# EAGLE design RadarEyes (EAGLE 9.2.2)
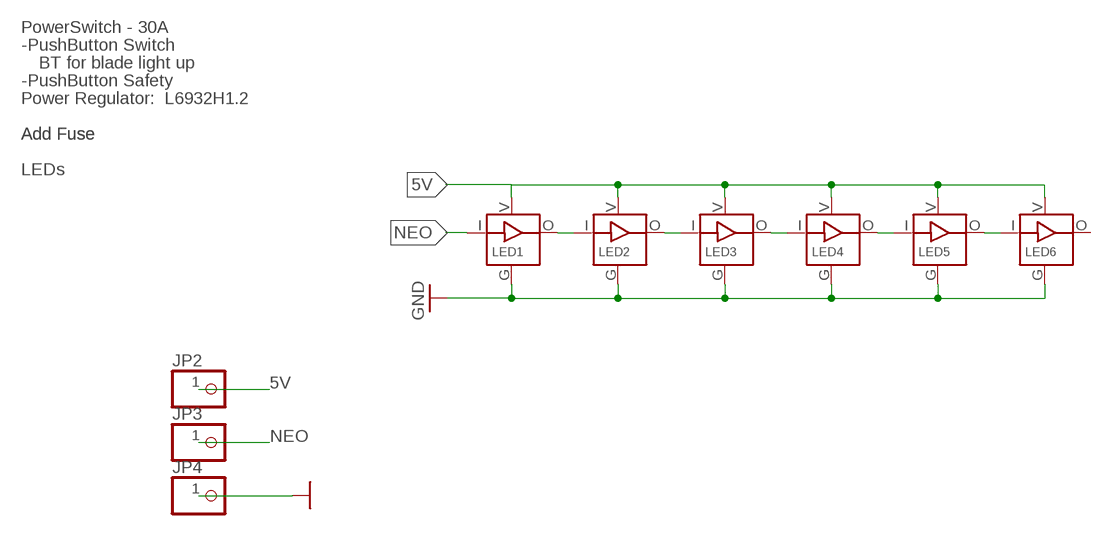
[diagram p0: schematic, sheet 1]

## Parts
JP2  PINHD-1X1  [1X01]
JP3  PINHD-1X1  [1X01]
JP4  PINHD-1X1  [1X01]
LED1  SK6812_3535  [LED3535]
LED2  SK6812_3535  [LED3535]
LED3  SK6812_3535  [LED3535]
LED4  SK6812_3535  [LED3535]
LED5  SK6812_3535  [LED3535]
LED6  SK6812_3535  [LED3535]

## Nets
5V: JP2.1 LED1.V(VDD) LED2.V(VDD) LED3.V(VDD) LED4.V(VDD) LED5.V(VDD) LED6.V(VDD)
GND: JP4.1 LED1.G(GND) LED2.G(GND) LED3.G(GND) LED4.G(GND) LED5.G(GND) LED6.G(GND)
N$1: LED1.O(DO) LED2.I(DI)
N$2: LED2.O(DO) LED3.I(DI)
N$3: LED3.O(DO) LED4.I(DI)
N$4: LED4.O(DO) LED5.I(DI)
N$5: LED5.O(DO) LED6.I(DI)
NEO: JP3.1 LED1.I(DI)
Unconnected: LED6.O(DO)

## Notes on the sheet
- PowerSwitch - 30A
- -PushButton Switch
- BT for blade light up
- -PushButton Safety
- Power Regulator:  L6932H1.2
- Add Fuse | Add Fuse
- LEDs

## Library data of the parts
JP2-JP4 = adafruit:PINHD-1X1: Pin header 1x1 for 0.1" spacing With round pins
LED1-LED6 = SK6812:SK6812

## Board
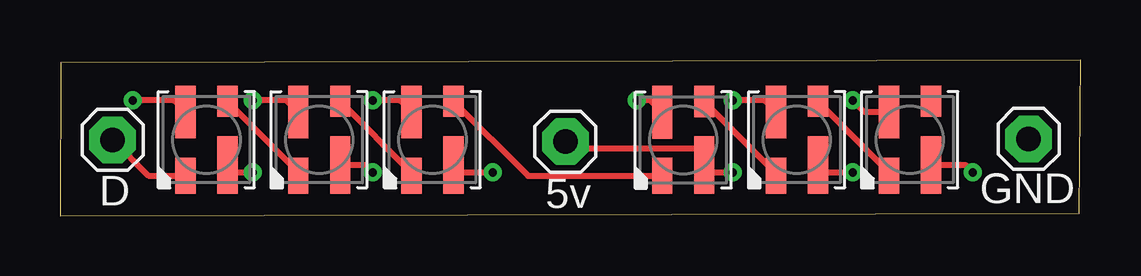
[diagram p1: board, top side]
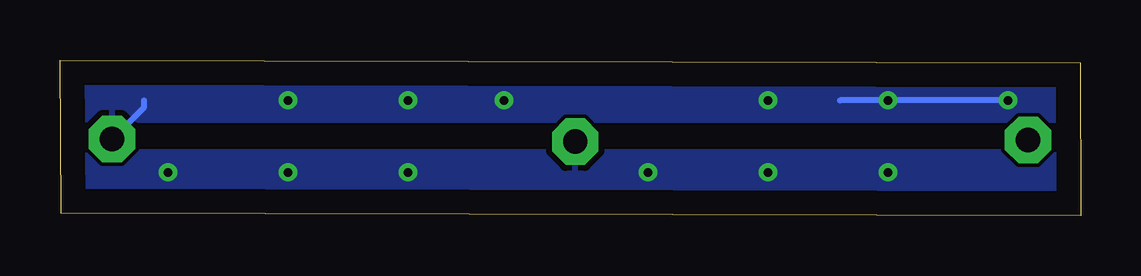
[diagram p2: board, bottom side, seen from below]

Size 42.53 x 6.49 mm. Coordinates in mm from the lower left corner, seen from the top.
Outline: 0,0 42.47,0.11 42.53,6.49 0.03,6.38 0,0
Copper layers (1*16): Top 0.035mm / dielectric 1.5mm / Bottom 0.035mm
Design rules "default *": minimum track width 6mil, minimum drill 0.35mm, track to track 6mil, track to pad 6mil, pad to pad 6mil, via to via 6mil, smd to smd 6mil, copper to edge 40mil, drill to drill 6mil, minimum pad ring 10mil, minimum via ring 8mil, stop-mask expansion 4mil, vias tented up to drill 0mil, thermal gap 10mil

### Footprints (pad centres in the part's own frame; a part is rotated, then mirrored left to right if it is on the bottom)
1X01 = drill 1.016 pad 1.93 octagon: 1 0,0
LED3535 = smd 2.2 x 0.85: G 1.15,0.875 | smd 1.5 x 0.85: I -1.5,0.875 | smd 1.3 x 0.85: O 1.6,-0.875 | smd 2.4 x 0.85: V -1.05,-0.875

### Placement (x,y rotation side)
JP2  21.06,3.09 0 top
JP3  2.19,3.16 0 top
JP4  40.36,3.2 0 top
LED1  6.1,3.17 90 top
LED2  10.8,3.17 90 top
LED3  15.52,3.17 90 top
LED4  25.97,3.16 90 top
LED5  30.7,3.17 90 top
LED6  35.41,3.17 90 top

### Tracks (layer width: path | path; a pad name or v marks a point on that pad's centre or on a via)
5V  (via drill 0.35)
  Top 0.254: JP2.1 21.34,2.81 27.03,2.81 | LED6.V 37.72,2.12 v38.03,1.81 | LED5.V 31.89,1.81 v33.03,1.81 | LED4.V 27.15,1.81 v28.03,1.81 | LED3.V 16.71,1.81 v18.03,1.81 | LED2.V 12.72,2.12 v13.03,1.81 | LED1.V 7.29,1.81 v8.03,1.81
  pour Bottom: -0.68,2.71 44.72,2.71 44.72,-0.13 -0.71,-0.13 -0.71,2.64
GND  (via drill 0.35)
  Top 0.254: LED1.G 4.74,4.81 v3.03,4.81 | LED2.G 9.44,4.81 v8.03,4.81 | LED3.G 14.16,4.81 v13.03,4.81 | LED4.G 24.6,4.81 v24.03,4.81 | LED5.G 29.34,4.81 v28.03,4.81 | LED6.G 33.52,4.32 v33.03,4.81
  Bottom 0.254: v3.03,4.81 v8.03,4.81 10.03,4.81 | JP4.1 39.03,4.53 39.03,4.81
  pour Bottom: 48.63,3.94 -0.69,3.94 -0.73,3.98 -0.73,6.59 48.21,6.59 46.44,4.82
N$1
  Top 0.254: LED1.O 9.93,1.82 LED2.I
N$2
  Top 0.254: LED2.O 14.65,1.8 LED3.I
N$3
  Top 0.254: LED3.O 19.51,1.66 LED4.I
N$4
  Top 0.254: LED4.O 29.83,1.78 LED5.I
N$5
  Top 0.254: LED5.O 34.54,1.81 LED6.I
NEO
  Top 0.254: JP3.1 3.68,1.67 LED1.I

### Text on the board
tPlace: D | 5v | GND